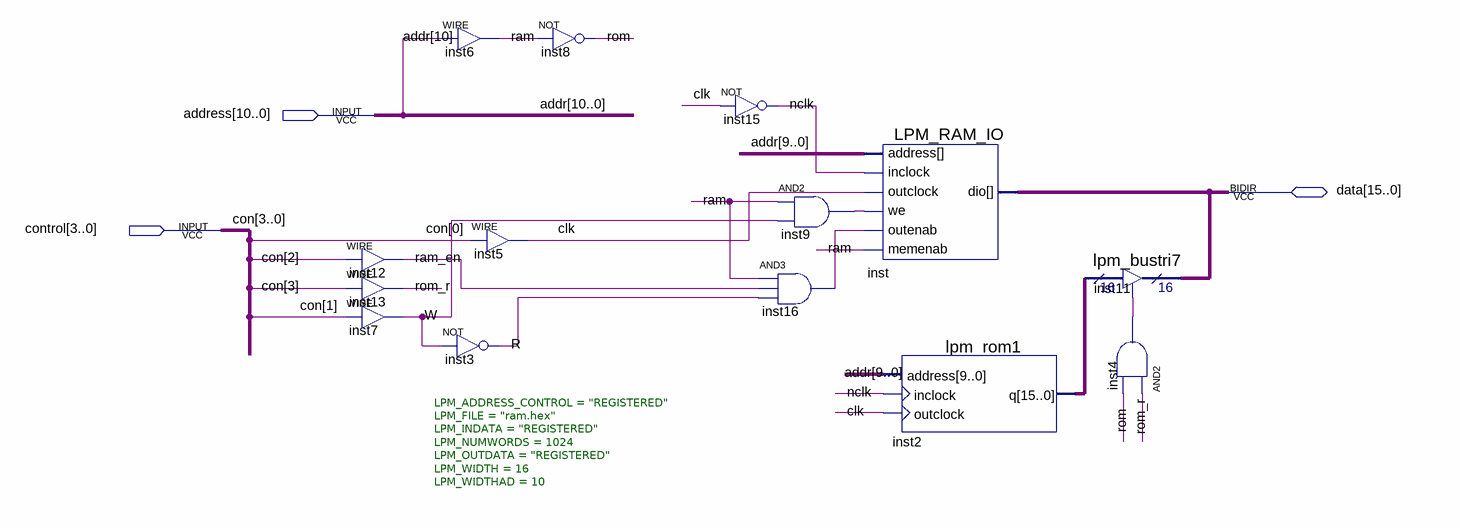
[diagram p0: schematic sheet]
// Quartus schematic ram_block.bdf as structural Verilog: 14 symbols, 3 pins
module ram_block (
  input  [10:0] address,
  input  [3:0] control,
  inout  [15:0] data
);

  wire clk, inst4_out, inst9_out, inst16_out, nclk, R, ram, ram_en, rom, rom_r, W;
  wire [15:0] inst2_q;

  assign ram_en = control[2];  // WIRE inst12
  assign rom_r = control[3];  // WIRE inst13
  assign W = control[1];  // WIRE inst7
  assign ram = address[10];  // WIRE inst6
  not inst3 (R, W);
  assign clk = control[0];  // WIRE inst5
  not inst8 (rom, ram);
  not inst15 (nclk, clk);
  and inst9 (inst9_out, ram, W);
  and inst16 (inst16_out, ram, ram_en, R);
  LPM_RAM_IO #(.LPM_ADDRESS_CONTROL("REGISTERED"), .LPM_FILE("ram.hex"), .LPM_INDATA("REGISTERED"), .LPM_NUMWORDS(1024), .LPM_OUTDATA("REGISTERED"), .LPM_WIDTH(16), .LPM_WIDTHAD(10)) inst (
    .address(address[9:0]), .outclock(clk), .memenab(ram), .inclock(nclk), .we(inst9_out),
    .outenab(inst16_out), .dio(data));
  lpm_rom1 inst2 (.address(address[9:0]), .inclock(nclk), .outclock(clk), .q(inst2_q));
  lpm_bustri7 inst11 (.enabledt(inst4_out), .data(inst2_q), .tridata(data));
  and inst4 (inst4_out, rom_r, rom);

  // Other names for the same wires on the sheet: addr[10:0] = address; con[3:0] = control
endmodule
